# EAGLE design ATmega324 code loader (EAGLE 5.06)
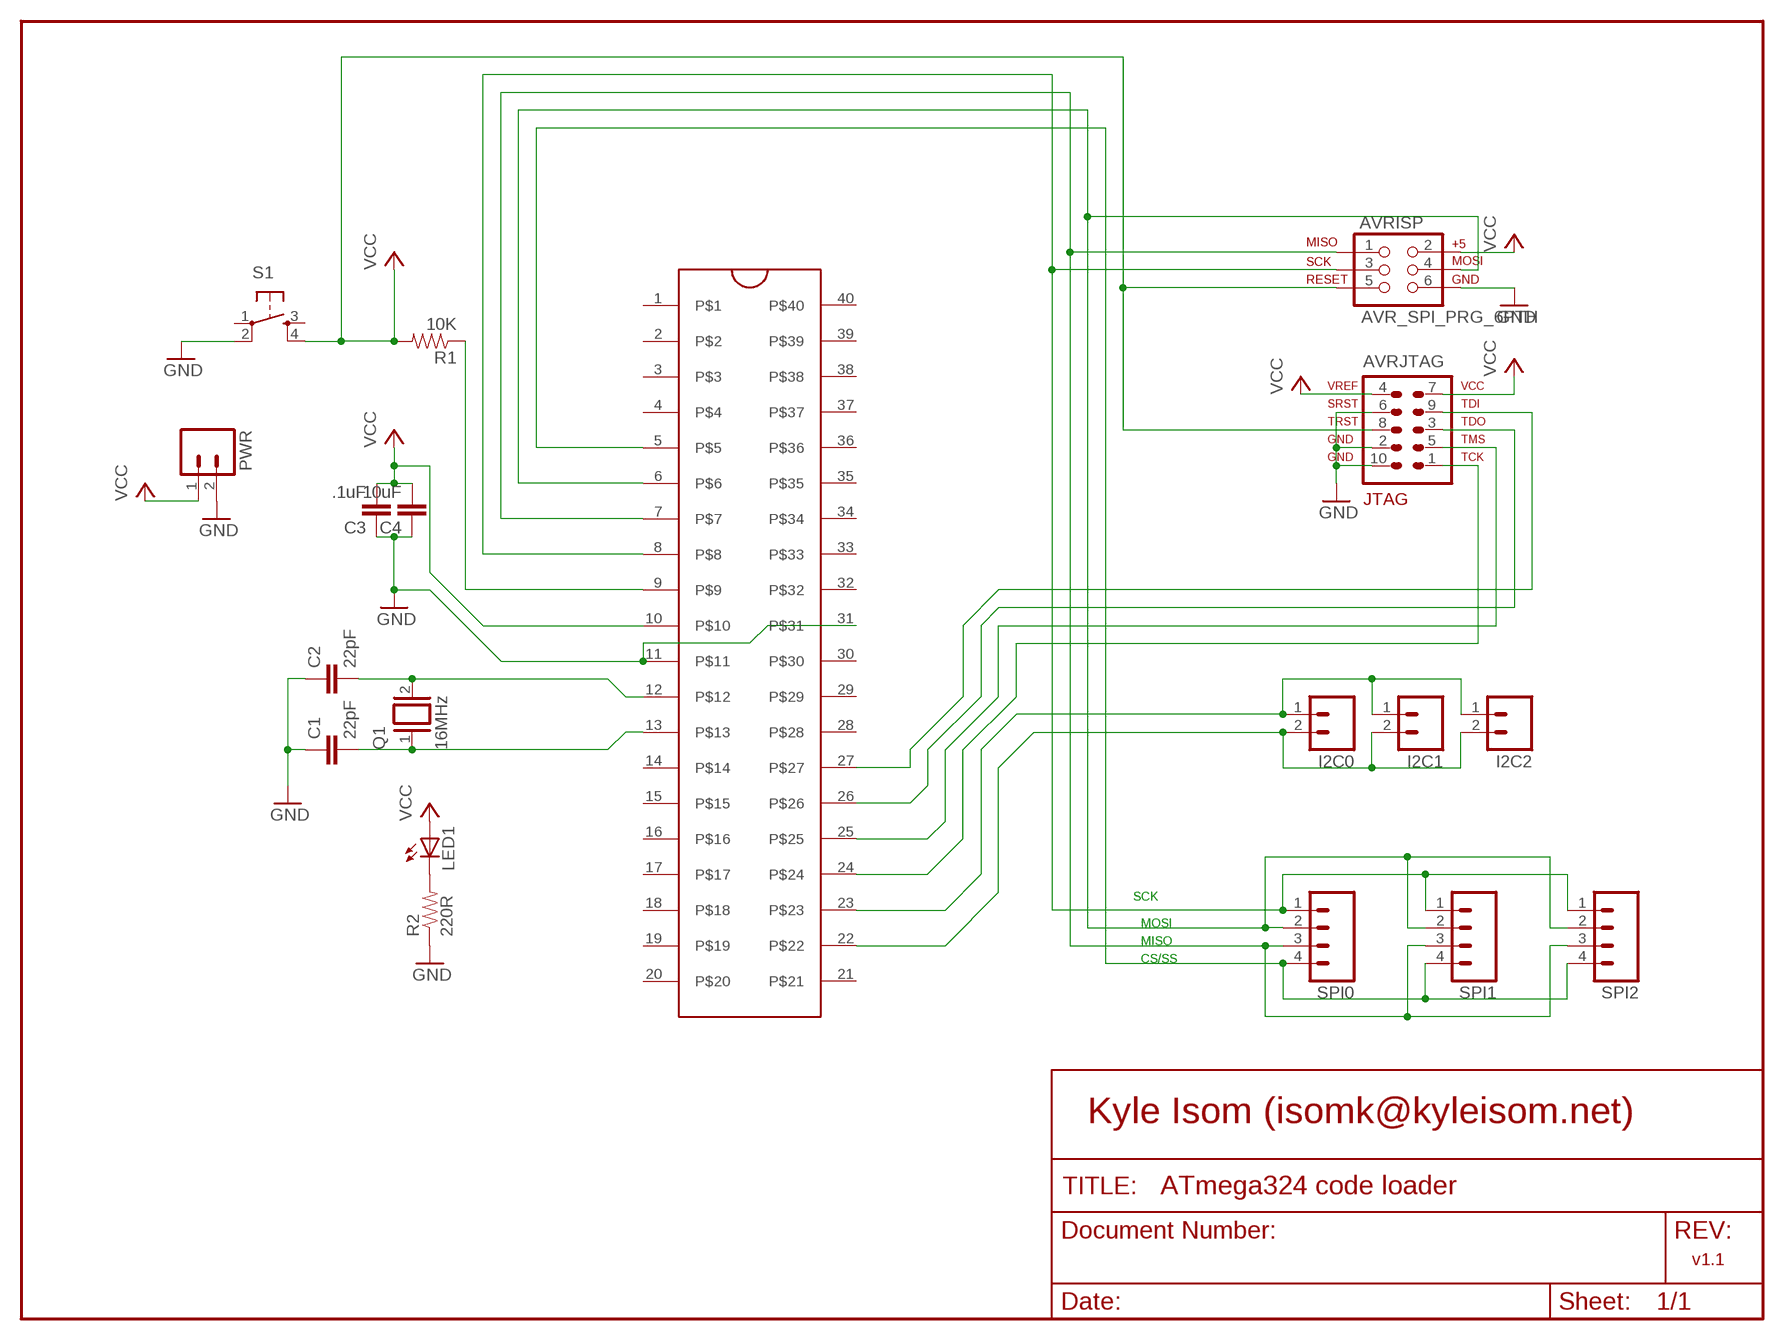
[diagram p0: schematic, sheet 1]

## Parts
ATMEGA164/324/644  ZIFSOCKET-40-6DIL40-6-ZIF_SOCKET  [DIL40-6-ZIF_SOCKET]
AVRISP  AVR_SPI_PRG_6PTH  [2X3]
AVRJTAG  AVR-JTAG-10  [AVR-JTAG-10]
C1  22pF  CAPPTH1  [CAP-PTH-5MM]
C2  22pF  CAPPTH1  [CAP-PTH-5MM]
C3  .1uF  CAPPTH1  [CAP-PTH-5MM]
C4  10uF  CAPPTH1  [CAP-PTH-5MM]
I2C0  M02LOCK  [1X02_LOCK]
I2C1  M02LOCK  [1X02_LOCK]
I2C2  M02LOCK  [1X02_LOCK]
LED1  LED5MM  [LED5MM]
PWR  M02POLAR_LOCK  [MOLEX-1X2_LOCK]
Q1  16MHz  XTAL/S  [QS]
R1  10K  RESISTORPTH1  [AXIAL-0.3]
R2  220R  RESISTORPTH1  [AXIAL-0.3]
S1  TAC_SWITCHPTH  [TACTILE-PTH]
SPI0  M04LOCK  [1X04_LOCK]
SPI1  M04LOCK  [1X04_LOCK]
SPI2  M04LOCK  [1X04_LOCK]

## Nets
GND: ATMEGA164/324/644.11 ATMEGA164/324/644.31 AVRISP.6 AVRJTAG.2 AVRJTAG.6 AVRJTAG.10 C1.1 C2.1 C3.1 C4.1 PWR.2 R2.P$1 S1.2
N$1: ATMEGA164/324/644.12 C2.2 Q1.2
N$2: ATMEGA164/324/644.13 C1.2 Q1.1
N$3: ATMEGA164/324/644.25 AVRJTAG.5
N$4: LED1.K(C) R2.P$2
N$6: ATMEGA164/324/644.9 R1.P$1
N$7: ATMEGA164/324/644.23 I2C0.1 I2C1.1 I2C2.1
N$8: ATMEGA164/324/644.22 I2C0.2 I2C1.2 I2C2.2
N$9: ATMEGA164/324/644.8 AVRISP.3 SPI0.1 SPI1.1 SPI2.1
N$10: ATMEGA164/324/644.6 AVRISP.4 SPI0.2 SPI1.2 SPI2.2
N$11: ATMEGA164/324/644.5 SPI0.4 SPI1.4 SPI2.4
N$12: ATMEGA164/324/644.7 AVRISP.1 SPI0.3 SPI1.3 SPI2.3
N$13: ATMEGA164/324/644.24 AVRJTAG.1
N$14: ATMEGA164/324/644.26 AVRJTAG.3
N$15: ATMEGA164/324/644.27 AVRJTAG.9
VCC: ATMEGA164/324/644.10 AVRISP.2 AVRISP.5 AVRJTAG.4 AVRJTAG.7 AVRJTAG.8 C3.2 C4.2 LED1.A PWR.1 R1.P$2 S1.4
Unconnected: ATMEGA164/324/644.1 ATMEGA164/324/644.2 ATMEGA164/324/644.3 ATMEGA164/324/644.4 ATMEGA164/324/644.14 ATMEGA164/324/644.15 ATMEGA164/324/644.16 ATMEGA164/324/644.17 ATMEGA164/324/644.18 ATMEGA164/324/644.19 ATMEGA164/324/644.20 ATMEGA164/324/644.21 ATMEGA164/324/644.28 ATMEGA164/324/644.29 ATMEGA164/324/644.30 ATMEGA164/324/644.32 ATMEGA164/324/644.33 ATMEGA164/324/644.34 ATMEGA164/324/644.35 ATMEGA164/324/644.36 ATMEGA164/324/644.37 ATMEGA164/324/644.38 ATMEGA164/324/644.39 ATMEGA164/324/644.40 S1.1 S1.3

## Notes on the sheet
- SCK
- MOSI
- MISO
- CS/SS
- Kyle Isom (isomk@kyleisom.net)
- v1.1

## Library data of the parts
ATMEGA164/324/644 = SparkFun:ZIFSOCKET-40-6
AVRISP = SparkFun:AVR_SPI_PRG_6: AVR ISP 6 Pin This is the reduced ISP connector for AVR programming. Common on Arduino. This footprint will take up less PCB space and can be used with a 10-pin to 6-pin adapter such as SKU: BOB-08508
AVRJTAG = avr-6:AVR-JTAG-10: AVR JTAG Debug/Programming Header
C1-C4 = SparkFun:CAP: Capacitor Standard 0603 ceramic capacitor, and 0.1" leaded capacitor.
I2C0 I2C1 I2C2 PWR = SparkFun:M02: Header 2 Standard 2-pin 0.1" header. Use with straight break away headers (SKU : PRT-00116), right angle break away headers (PRT-00553), swiss pins (PRT-00743), machine pins (PRT-00117), and female headers (PRT-00115). Molex polarized connector foot print use with SKU : PRT-08233 with associated crimp pins and housings.
LED1 = led:LED: LED OSRAM: - CHIPLED LG R971, LG N971, LY N971, LG Q971, LY Q971, LO R971, LY R971 LH N974, LH R974 LS Q976, LO Q976, LY Q976 LO Q996 - Hyper CHIPLED LW Q18S LB Q993, LB Q99A, LB R99A - SideLED LS A670, LO A670, LY A670, LG A670, LP A670 LB A673, LV A673, LT A673, LW A673 LH A674 LY A675 LS A676, LA A676, LO A676, LY A676, LW A676 LS A679, LY A679, LG A679 - Hyper Micro SIDELED® LS Y876, LA Y876, LO Y876, LY Y876 LT Y87S - SmartLED LW L88C, LW L88S LB L89C, LB L89S, LG L890 LS L89K, LO L89K, LY L89K LS L896, LA L896, LO L896, LY L896 - TOPLED LS T670, LO T670, LY T670, LG T670, LP T670 LSG T670, LSP T670, LSY T670, LOP T670, LYG T670 LG T671, LOG T671, LSG T671 LB T673, LV T673, LT T673, LW T673 LH T674 LS T676, LA T676, LO T676, LY T676, LB T676, LH T676, LSB T676, LW T676 LB T67C, LV T67C, LT T67C, LS T67K, LO T67K, LY T67K, LW E67C LS E67B, LA E67B, LO E67B, LY E67B, LB E67C, LV E67C, LT E67C LW T67C LS T679, LY T679, LG T679 LS T770, LO T770, LY T770, LG T770, LP T770 LB T773, LV T773, LT T773, LW T773 LH T774 LS E675, LA E675, LY E675, LS T675 LS T776, LA T776, LO T776, LY T776, LB T776 LHGB T686 LT T68C, LB T68C - Hyper Mini TOPLED® LB M676 - Mini TOPLED Santana® LG M470 LS M47K, LO M47K, LY M47K Source: http://www.osram.convergy.de LUXEON: - LUMILED® LXK2-PW12-R00, LXK2-PW12-S00, LXK2-PW14-U00, LXK2-PW14-V00 LXK2-PM12-R00, LXK2-PM12-S00, LXK2-PM14-U00 LXK2-PE12-Q00, LXK2-PE12-R00, LXK2-PE12-S00, LXK2-PE14-T00, LXK2-PE14-U00 LXK2-PB12-K00, LXK2-PB12-L00, LXK2-PB12-M00, LXK2-PB14-N00, LXK2-PB14-P00, LXK2-PB14-Q00 LXK2-PR12-L00, LXK2-PR12-M00, LXK2-PR14-Q00, LXK2-PR14-R00 LXK2-PD12-Q00, LXK2-PD12-R00, LXK2-PD12-S00 LXK2-PH12-R00, LXK2-PH12-S00 LXK2-PL12-P00, LXK2-PL12-Q00, LXK2-PL12-R00 Source: www.luxeon.com KINGBRIGHT: KA-3528ASYC Source: www.kingbright.com
Q1 = special:XTAL/S: CRYSTAL
R1 R2 = SparkFun:RESISTOR: Resistor Basic schematic elements and footprints for 0603, 1206, and PTH 1/10th watt (small) resistors.
S1 = SparkFun:TAC_SWITCH: Momentary Switch Button commonly used for reset or general input. Spark Fun Electronics SKU : COM-00097
SPI0 SPI1 SPI2 = SparkFun:M04: Header 4 Standard 4-pin 0.1" header. Use with straight break away headers (SKU : PRT-00116), right angle break away headers (PRT-00553), swiss pins (PRT-00743), machine pins (PRT-00117), and female headers (PRT-00115). Molex polarized connector foot print use with SKU : PRT-08231 with associated crimp pins and housings.

## Board
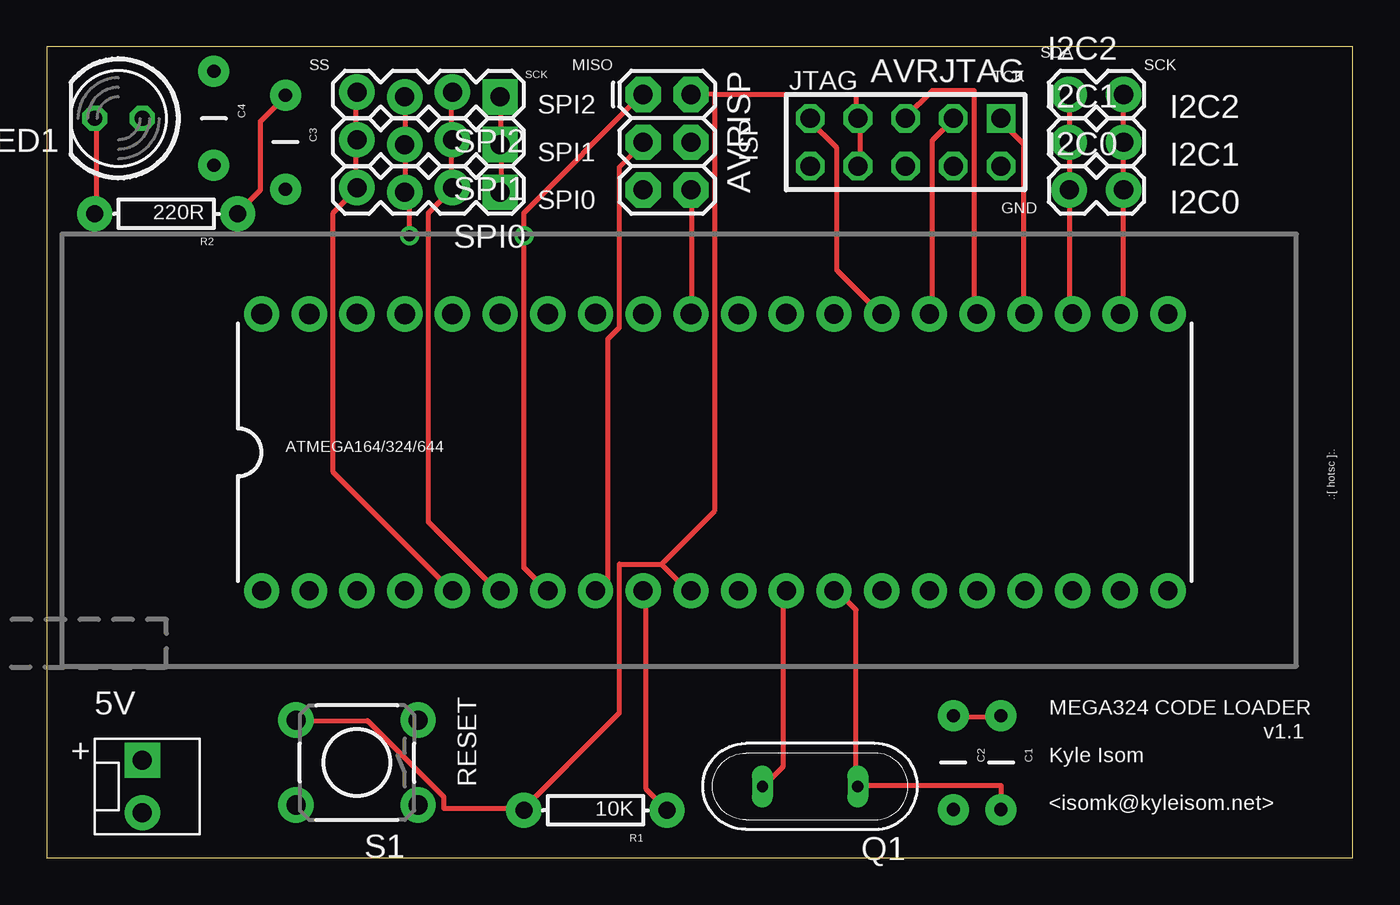
[diagram p1: board, top side]
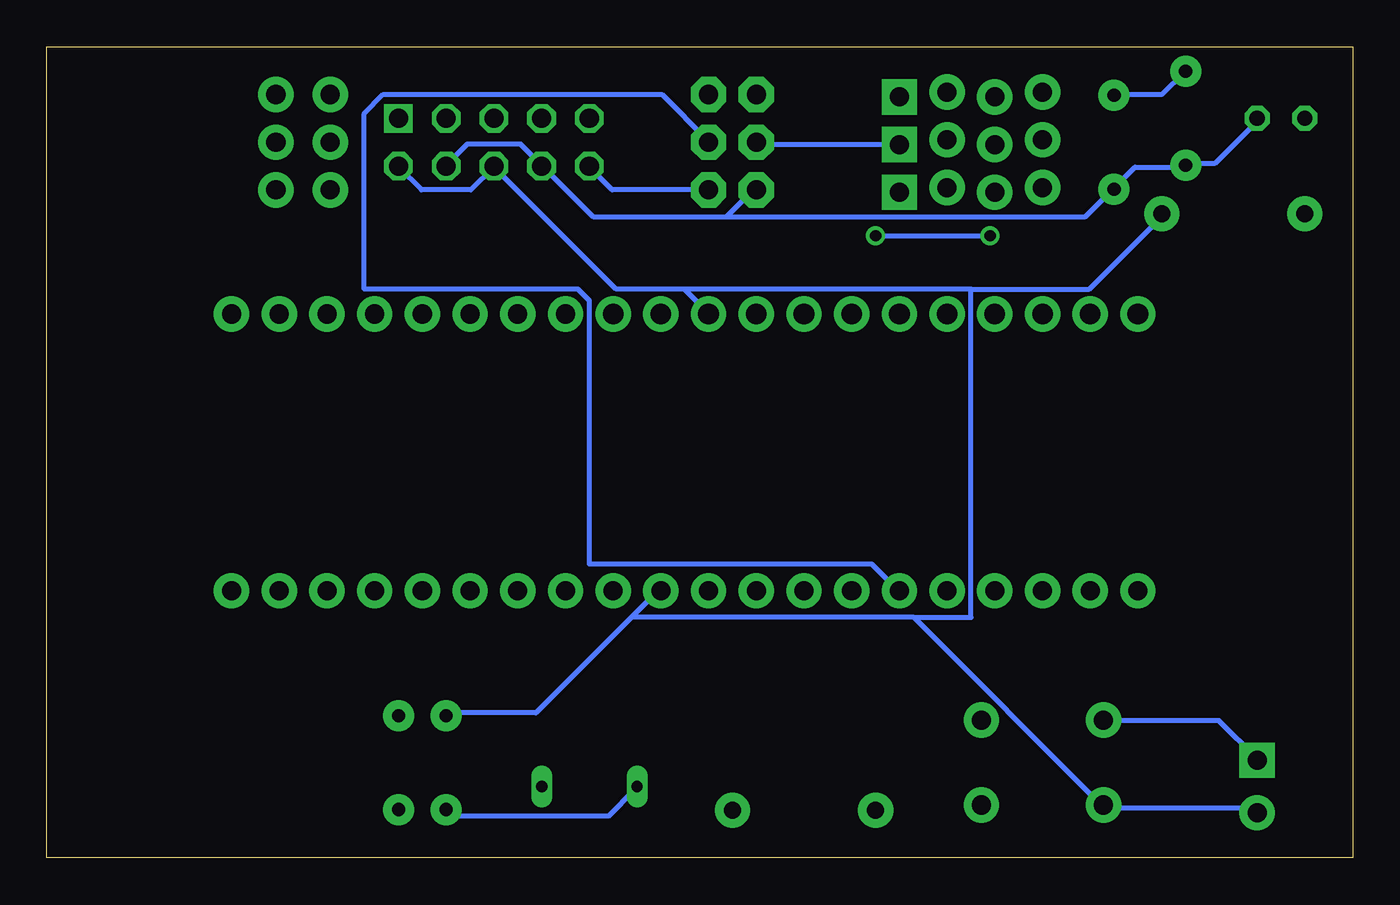
[diagram p2: board, bottom side, seen from below]

Size 69.52 x 43.17 mm. Coordinates in mm from the lower left corner, seen from the top.
Outline: 0,0 69.52,0 69.52,43.17 0,43.17 0,0
Copper layers (1*16): Top 0.035mm / dielectric 1.5mm / Bottom 0.035mm
Design rules "default": minimum track width 10mil, minimum drill 24mil, track to track 8mil, track to pad 8mil, pad to pad 8mil, via to via 8mil, smd to smd 8mil, copper to edge 40mil, drill to drill 8mil, minimum pad ring 10mil, minimum via ring 8mil, stop-mask expansion 4mil, vias tented up to drill 0mil, thermal gap 10mil

### Footprints (pad centres in the part's own frame; a part is rotated, then mirrored left to right if it is on the bottom)
DIL40-6-ZIF_SOCKET = drill 1.016 pad 1.88 round: 1 -24.13,-7.366; 2 -21.59,-7.366; 3 -19.05,-7.366; 4 -16.51,-7.366; 5 -13.97,-7.366; 6 -11.43,-7.366; 7 -8.89,-7.366; 8 -6.35,-7.366; 9 -3.81,-7.366; 10 -1.27,-7.366; 11 1.27,-7.366; 12 3.81,-7.366; 13 6.35,-7.366; 14 8.89,-7.366; 15 11.43,-7.366; 16 13.97,-7.366; 17 16.51,-7.366; 18 19.05,-7.366; 19 21.59,-7.366; 20 24.13,-7.366; 21 24.13,7.366; 22 21.59,7.366; 23 19.05,7.366; 24 16.51,7.366; 25 13.97,7.366; 26 11.43,7.366; 27 8.89,7.366; 28 6.35,7.366 | drill 1.1 pad 1.88 round: 29 3.81,7.366; 30 1.27,7.366; 31 -1.27,7.366; 32 -3.81,7.366; 33 -6.35,7.366; 34 -8.89,7.366; 35 -11.43,7.366; 36 -13.97,7.366; 37 -16.51,7.366; 38 -19.05,7.366; 39 -21.59,7.366; 40 -24.13,7.366
2X3 = drill 1.016 pad 1.88 octagon: 1 0,0; 2 0,2.54; 3 2.54,0; 4 2.54,2.54; 5 5.08,0; 6 5.08,2.54
AVR-JTAG-10 = drill 1.016 square: 1 -5.08,-1.27 | drill 1.016 octagon: 2 -5.08,1.27; 3 -2.54,-1.27; 4 -2.54,1.27; 5 0,-1.27; 6 0,1.27; 7 2.54,-1.27; 8 2.54,1.27; 9 5.08,-1.27; 10 5.08,1.27
CAP-PTH-5MM = drill 0.7 pad 1.651 round: 1 -2.5,0; 2 2.5,0
1X02_LOCK = drill 1.016 pad 1.88 round: 1 -0.178,0; 2 2.718,0
LED5MM = drill 0.813 octagon: A -1.27,0; K 1.27,0
MOLEX-1X2_LOCK = drill 1.016 pad 1.88 square: 1 -0.127,0 | drill 1.016 pad 1.88 round: 2 2.667,0
QS = drill 0.61 long: 1 -2.54,0; 2 2.54,0
AXIAL-0.3 = drill 0.9 pad 1.88 round: P$1 -3.81,0; P$2 3.81,0
TACTILE-PTH = drill 1.016 pad 1.88 round: 1 -3.251,2.261; 2 3.251,2.261; 3 -3.251,-2.261; 4 3.251,-2.261
1X04_LOCK = drill 1.016 pad 1.88 square: 1 0,0.127 | drill 1.016 pad 1.88 round: 2 2.54,-0.127; 3 5.08,0.127; 4 7.62,-0.127

### Placement (x,y rotation side)
ATMEGA164/324/644  35.56,21.59 0 top
AVRISP  31.75,40.64 270 top
AVRJTAG  45.72,38.1 180 top
C1  50.8,5.08 270 top
C2  48.26,5.08 270 top
C3  12.7,38.1 270 top
C4  8.89,39.37 270 top
I2C0  54.61,35.56 0 top
I2C1  54.61,38.1 0 top
I2C2  54.61,40.64 0 top
LED1  3.81,39.37 180 top
PWR  5.08,5.08 270 top
Q1  40.64,3.81 180 top
R1  29.21,2.54 180 top
R2  6.35,34.29 180 top
S1  16.51,5.08 180 top
SPI0  24.13,35.56 180 top
SPI1  24.13,38.1 180 top
SPI2  24.13,40.64 180 top

### Tracks (layer width: path | path; a pad name or v marks a point on that pad's centre or on a via)
GND
  Top 0.254: R2.P$1 10.16,34.34 11.38,35.56 11.38,39.22 12.6,40.44 C3.1 | ATMEGA164/324/644.31 34.34,29.06 34.34,35.56 AVRISP.6 | C2.1 48.36,7.52 50.8,7.52 C1.1
  Bottom 0.254: C4.1 8.94,41.86 10.16,40.64 12.6,40.64 C3.1 | 45.72,36.78 46.94,35.56 49.58,35.56 50.8,36.78 AVRJTAG.2 | AVRJTAG.10 40.64,36.78 39.42,35.56 AVRISP.6 | 45.72,36.78 39.22,30.28 35.56,30.28 | 35.56,30.28 34.34,29.06 ATMEGA164/324/644.31 | 45.72,36.78 AVRJTAG.6 | 20.32,30.28 35.56,30.28 | 20.32,30.28 14.02,30.28 10.16,34.14 R2.P$1 | PWR.2 5.08,2.44 5.28,2.64 13.21,2.64 S1.2 13.41,2.85 23.37,12.8 | 38.41,12.8 43.48,7.72 48.16,7.72 C2.1 | 38.41,12.8 36.98,14.22 ATMEGA164/324/644.11 | 23.37,12.8 38.41,12.8 | 20.32,30.28 20.32,12.8 23.37,12.8
N$1
  Top 0.254: Q1.2 38.2,3.86 39.22,4.88 39.22,14.22 ATMEGA164/324/644.12
  Bottom 0.254: C2.2 48.16,2.44 47.95,2.23 39.62,2.23 38.2,3.66 Q1.2
N$2
  Top 0.254: C1.2 50.8,3.86 43.28,3.86 Q1.1 43.08,3.86 43.08,13.21 42.06,14.22 ATMEGA164/324/644.13
N$3
  Top 0.254: AVRJTAG.5 45.72,39.42 47.14,40.84 49.38,40.84 49.38,29.06 ATMEGA164/324/644.25
N$4
  Top 0.254: LED1.K 2.64,39.22 2.64,34.34 R2.P$2
N$6
  Top 0.254: R1.P$1 31.9,3.66 31.9,14.22 ATMEGA164/324/644.9
N$7
  Top 0.254: 54.46,35.56 54.46,38 I2C1.1 54.46,38.2 54.46,40.64 I2C2.1 | 54.46,35.56 54.46,29.06 ATMEGA164/324/644.23 | 54.46,35.56 I2C0.1
N$8
  Top 0.254: I2C2.2 57.3,40.64 57.3,38.2 I2C1.2 57.3,38 57.3,35.56 | 57.3,35.56 57.3,29.06 ATMEGA164/324/644.22 | 57.3,35.56 I2C0.2
N$9
  Top 0.254: SPI0.1 24.18,35.56 24.18,37.8 SPI1.1 24.18,38 24.18,40.44 SPI2.1 | ATMEGA164/324/644.8 29.26,14.22 29.87,14.83 29.87,27.64 30.48,28.25 30.48,36.78 31.7,38 AVRISP.3
  Bottom 0.254: SPI1.1 24.18,38 31.7,38 AVRISP.3
N$10
  Top 0.254: SPI2.2 21.54,40.64 21.54,38.41 SPI1.2 21.54,38.2 21.54,35.76 SPI0.2 21.54,35.56 20.32,34.34 20.32,17.88 23.98,14.22 ATMEGA164/324/644.6
  Bottom 0.254: AVRISP.4 34.34,38.2 36.78,40.64 51.61,40.64 52.63,39.62 52.63,30.28 41.25,30.28 40.64,29.67 40.64,15.65 25.6,15.65 24.18,14.22 ATMEGA164/324/644.6
N$11
  Top 0.254: SPI2.4 16.46,40.64 16.46,38.41 SPI1.4 16.46,38.2 16.46,35.76 SPI0.4 16.46,35.56 15.24,34.34 15.24,20.52 21.54,14.22 ATMEGA164/324/644.5
N$12  (via drill 0.61)
  Top 0.254: SPI2.3 19.1,40.44 19.1,38 SPI1.3 19.1,37.8 19.1,35.56 SPI0.3 19.1,35.36 19.3,35.15 v19.3,33.12 | ATMEGA164/324/644.7 26.62,14.22 25.4,15.44 v25.4,33.12 25.4,34.34 31.7,40.64 AVRISP.1
  Bottom 0.254: v25.4,33.12 v19.3,33.12
N$13
  Top 0.254: AVRJTAG.1 50.8,39.22 52.02,38 52.02,29.06 ATMEGA164/324/644.24
N$14
  Top 0.254: AVRJTAG.3 48.16,39.22 47.14,38.2 47.14,29.06 ATMEGA164/324/644.26
N$15
  Top 0.254: AVRJTAG.9 40.64,39.22 42.06,37.8 42.06,31.29 44.3,29.06 ATMEGA164/324/644.27
VCC
  Top 0.254: 25.4,2.64 21.13,2.64 21.13,3.25 17.07,7.32 13.41,7.32 S1.4 | 32.72,15.65 34.14,14.22 ATMEGA164/324/644.10 | 32.72,15.65 30.48,15.65 30.48,7.72 25.4,2.64 | 25.4,2.64 R1.P$2 | AVRJTAG.8 43.28,36.98 43.28,39.22 AVRJTAG.7 43.08,39.42 43.08,40.64 35.56,40.64 | 35.56,40.64 AVRISP.2 | 32.72,15.65 35.56,18.49 35.56,40.64
  Bottom 0.254: PWR.1 5.08,5.28 7.11,7.32 13.21,7.32 S1.4 | LED1.A 5.08,39.22 7.32,36.98 8.74,36.98 C4.2 8.94,36.78 11.58,36.78 12.6,35.76 C3.2 12.8,35.56 14.22,34.14 33.33,34.14 | AVRJTAG.4 48.16,36.98 47.14,38 44.3,38 43.28,36.98 AVRJTAG.8 43.08,36.78 40.44,34.14 33.33,34.14 | 33.33,34.14 31.9,35.56 AVRISP.5

### Text on the board
tPlace: SDA | SS | SCK | MISO | JTAG | TCK | SCK | SPI2 | I2C2 | ISP | SPI1 | I2C1 | SPI0 | I2C0 | GND | .:[ hotsc ]:. | 5V | MEGA324 CODE LOADER | v1.1 | + | Kyle Isom | RESET | <isomk@kyleisom.net>